# EAGLE board StepperBoard (EAGLE 9.6.2), part 1 of 2
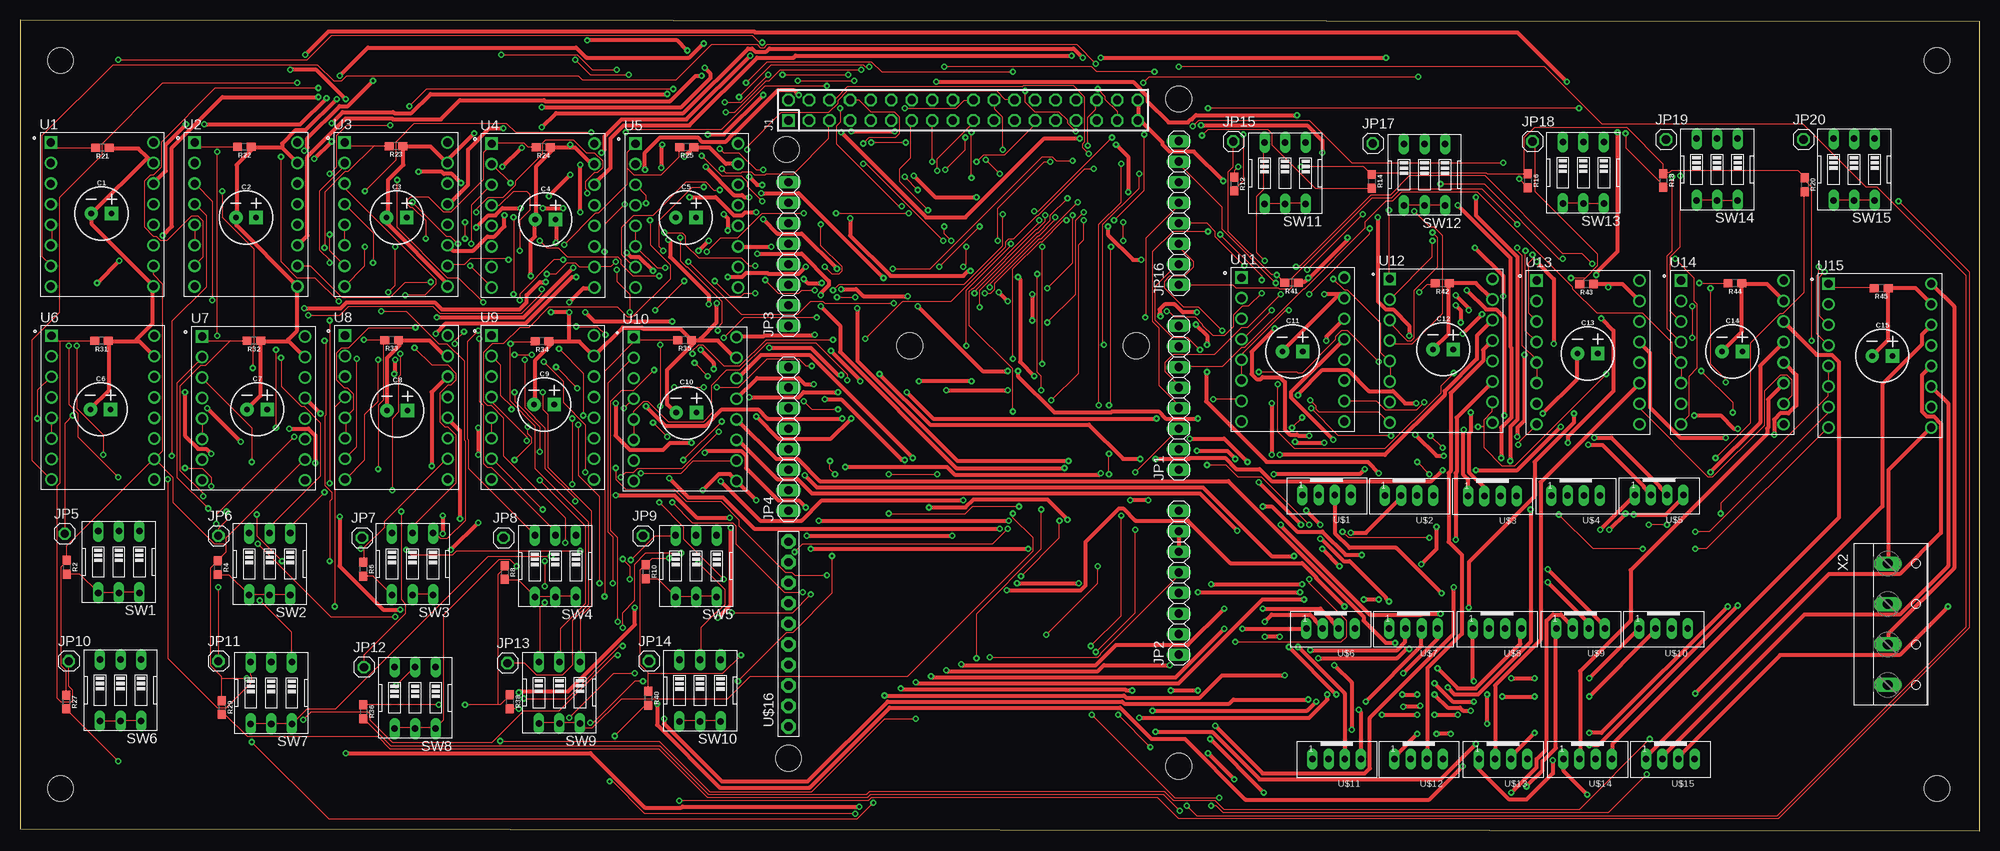
[diagram p2: board, top side]
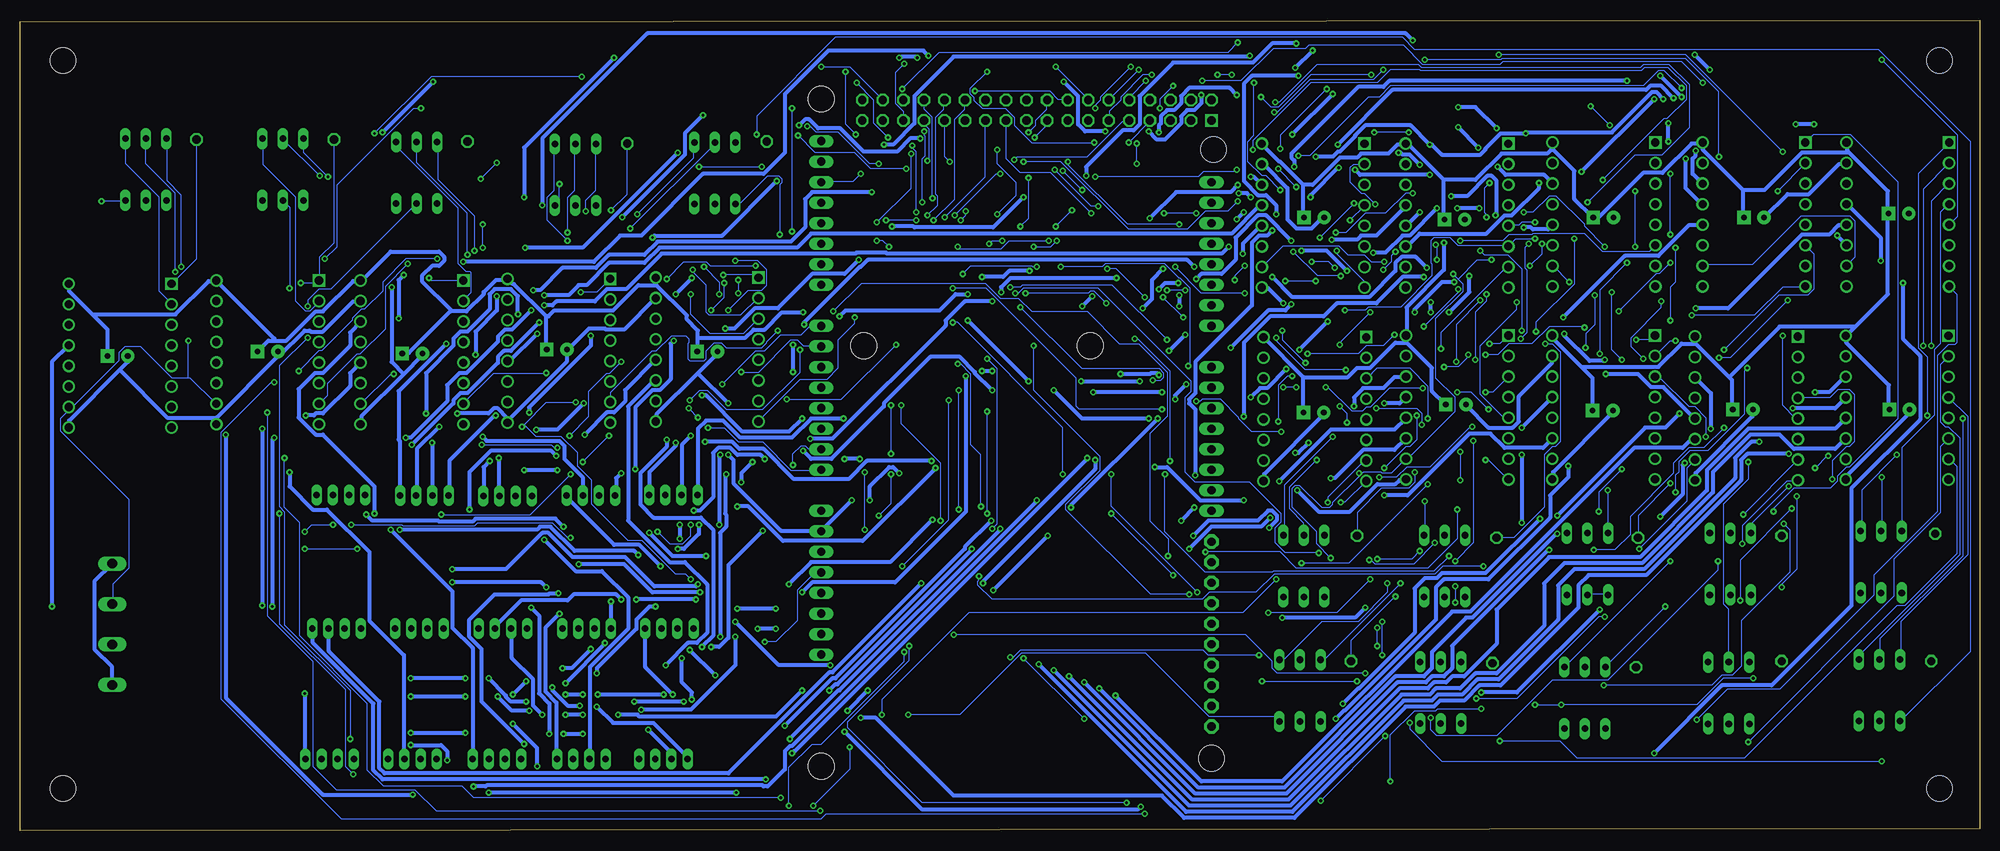
[diagram p3: board, bottom side, seen from below]

Size 242.3 x 100.2 mm. Coordinates in mm from the lower left corner, seen from the top.
Outline: 0,0.2 242.3,0 242.3,100 0,100.2 0,0.2
Copper layers (1*16): Top 0.035mm / dielectric 1.5mm / Bottom 0.035mm
Design rules "default": minimum track width 6mil, minimum drill 0.35mm, track to track 6mil, track to pad 6mil, pad to pad 6mil, via to via 6mil, smd to smd 6mil, copper to edge 40mil, drill to drill 6mil, minimum pad ring 10mil, minimum via ring 8mil, stop-mask expansion 4mil, vias tented up to drill 0mil, thermal gap 10mil
Net classes: 1 Motor: width 0.508 mm; 2 VMOT: width 0.508 mm; 3 GND: width 0.508 mm
Holes 3.2 mm at 5,95.2 5,5.2 237,5.2 237,95.2 94.75,84.2 95,8.95 143.25,90.45 143.25,7.95 110,59.95 138,59.95
tRestrict: area 1.8,92 to 8.2,98.4; area 1.8,2 to 8.2,8.4; area 233.8,2 to 240.2,8.4; area 233.8,92 to 240.2,98.4
bRestrict: area 1.8,92 to 8.2,98.4; area 1.8,2 to 8.2,8.4; area 233.8,2 to 240.2,8.4; area 233.8,92 to 240.2,98.4
vRestrict: area 1.8,92 to 8.2,98.4; area 1.8,2 to 8.2,8.4; area 233.8,2 to 240.2,8.4; area 233.8,92 to 240.2,98.4

## Footprints (pad centres in the part's own frame; a part is rotated, then mirrored left to right if it is on the bottom)
CPOL-RADIAL-2.5MM-6.5MM = drill 0.7 pad 1.651 square: 1 1.25,0 | drill 0.7 pad 1.651: 2 -1.25,0
DIL-100-2X18 = drill 1.016 square: 1 -21.59,-1.27 | drill 1.016 octagon: 2 -21.59,1.27; 3 -19.05,-1.27; 4 -19.05,1.27; 5 -16.51,-1.27; 6 -16.51,1.27; 7 -13.97,-1.27; 8 -13.97,1.27; 9 -11.43,-1.27; 10 -11.43,1.27; 11 -8.89,-1.27; 12 -8.89,1.27; 13 -6.35,-1.27; 14 -6.35,1.27; 15 -3.81,-1.27; 16 -3.81,1.27; 17 -1.27,-1.27; 18 -1.27,1.27; 19 1.27,-1.27; 20 1.27,1.27; 21 3.81,-1.27; 22 3.81,1.27; 23 6.35,-1.27; 24 6.35,1.27; 25 8.89,-1.27; 26 8.89,1.27; 27 11.43,-1.27; 28 11.43,1.27; 29 13.97,-1.27; 30 13.97,1.27; 31 16.51,-1.27; 32 16.51,1.27; 33 19.05,-1.27; 34 19.05,1.27; 35 21.59,-1.27; 36 21.59,1.27
1X08 = drill 1.016 long: 1 -8.89,0; 2 -6.35,0; 3 -3.81,0; 4 -1.27,0; 5 1.27,0; 6 3.81,0; 7 6.35,0; 8 8.89,0
1X01 = drill 1.016 octagon: 1 0,0
0603 = smd 1.1 x 1: 1 -0.85,0; 2 0.85,0
EDG-03 = drill 0.813 long: 1 -2.54,-3.81; 2 0,-3.81; 3 2.54,-3.81; 4 2.54,3.81; 5 0,3.81; 6 -2.54,3.81
MODULE_A4988_STEPPER_MOTOR_DRIVER_CARRIER = drill 1.02 square: 1 -6.35,8.89 | drill 1.02: 2 -6.35,6.35; 3 -6.35,3.81; 4 -6.35,1.27; 5 -6.35,-1.27; 6 -6.35,-3.81; 7 -6.35,-6.35; 8 -6.35,-8.89; 9 6.35,-8.89; 10 6.35,-6.35; 11 6.35,-3.81; 12 6.35,-1.27; 13 6.35,1.27; 14 6.35,3.81; 15 6.35,6.35; 16 6.35,8.89
JST_B4B-PH_HEADER = drill 0.8 long: P1 2.98,0.048; P2 0.98,0.048; P3 -1.02,0.048; P4 -3.02,0.048
1X10-BIG = drill 1.016 pad 1.778 octagon: 1 -11.43,0; 2 -8.89,0; 3 -6.35,0; 4 -3.81,0; 5 -1.27,0; 6 1.27,0; 7 3.81,0; 8 6.35,0; 9 8.89,0; 10 11.43,0
W237-4 = drill 1.194 long: 1 -7.5,-1.27; 2 -2.5,-1.27; 3 2.5,-1.27; 4 7.5,-1.27

## Placement (x,y rotation side)
C1  100uF  [CPOL-RADIAL-2.5MM-6.5MM]  10.04,76.3 0 top
C2  100uF  [CPOL-RADIAL-2.5MM-6.5MM]  27.92,75.8 0 top
C3  100uF  [CPOL-RADIAL-2.5MM-6.5MM]  46.55,75.8 0 top
C4  100uF  [CPOL-RADIAL-2.5MM-6.5MM]  64.93,75.55 0 top
C5  100uF  [CPOL-RADIAL-2.5MM-6.5MM]  82.31,75.8 0 top
C6  100uF  [CPOL-RADIAL-2.5MM-6.5MM]  9.93,52.08 0 top
C7  100uF  [CPOL-RADIAL-2.5MM-6.5MM]  29.3,52.08 0 top
C8  100uF  [CPOL-RADIAL-2.5MM-6.5MM]  46.62,51.93 0 top
C9  100uF  [CPOL-RADIAL-2.5MM-6.5MM]  64.79,52.68 0 top
C10  100uF  [CPOL-RADIAL-2.5MM-6.5MM]  82.36,51.68 0 top
C11  100uF  [CPOL-RADIAL-2.5MM-6.5MM]  157.33,59.25 0 top
C12  100uF  [CPOL-RADIAL-2.5MM-6.5MM]  175.95,59.5 0 top
C13  100uF  [CPOL-RADIAL-2.5MM-6.5MM]  193.82,59 0 top
C14  100uF  [CPOL-RADIAL-2.5MM-6.5MM]  211.69,59.25 0 top
C15  100uF  [CPOL-RADIAL-2.5MM-6.5MM]  230.25,58.7 0 top
J1  F-2X18-DIL-100  [DIL-100-2X18]  116.59,89.07 0 top
JP1  [1X08]  143.26,53.51 90 top
JP2  [1X08]  143.26,30.65 90 top
JP3  [1X08]  95,71.29 90 top
JP4  [1X08]  95,48.43 90 top
JP5  [1X01]  5.5,36.7 0 top
JP6  [1X01]  24.5,36.45 0 top
JP7  [1X01]  42.25,36.2 0 top
JP8  [1X01]  59.75,36.2 0 top
JP9  [1X01]  77,36.45 0 top
JP10  [1X01]  6,20.95 0 top
JP11  [1X01]  24.5,20.95 0 top
JP12  [1X01]  42.5,20.2 0 top
JP13  [1X01]  60.25,20.7 0 top
JP14  [1X01]  77.75,20.95 0 top
JP15  [1X01]  150,85.2 0 top
JP16  [1X08]  143.26,76.37 90 top
JP17  [1X01]  167.25,84.95 0 top
JP18  [1X01]  187,85.2 0 top
JP19  [1X01]  203.5,85.45 0 top
JP20  [1X01]  220.5,85.45 0 top
R2  4.7k  [0603]  5.75,32.56 270 top
R4  4.7k  [0603]  24.43,32.51 270 top
R6  4.7k  [0603]  42.41,32.31 270 top
R8  4.7k  [0603]  59.89,31.91 270 top
R10  4.7k  [0603]  77.37,32.01 270 top
R12  4.7k  [0603]  150.12,79.94 270 top
R14  4.7k  [0603]  167.12,80.27 270 top
R16  4.7k  [0603]  186.42,80.35 270 top
R18  4.7k  [0603]  203.17,80.38 270 top
R20  4.7k  [0603]  220.65,79.86 270 top
R21  4.7k  [0603]  10.17,84.42 180 top
R22  4.7k  [0603]  27.72,84.53 180 top
R23  4.7k  [0603]  46.47,84.64 180 top
R24  4.7k  [0603]  64.67,84.5 180 top
R25  4.7k  [0603]  82.42,84.51 180 top
R27  4.7k  [0603]  5.69,15.89 270 top
R29  4.7k  [0603]  24.94,15.22 270 top
R31  4.7k  [0603]  10.05,60.55 180 top
R32  4.7k  [0603]  28.89,60.55 180 top
R33  4.7k  [0603]  45.93,60.65 180 top
R34  4.7k  [0603]  64.52,60.5 180 top
R35  4.7k  [0603]  82.16,60.65 180 top
R36  4.7k  [0603]  42.44,14.7 270 top
R38  4.7k  [0603]  60.54,15.93 270 top
R40  4.7k  [0603]  77.67,16.36 270 top
R41  4.7k  [0603]  157.2,67.73 180 top
R42  4.7k  [0603]  175.84,67.68 180 top
R43  4.7k  [0603]  193.68,67.58 180 top
R44  4.7k  [0603]  212.02,67.68 180 top
R45  4.7k  [0603]  230.11,67.08 180 top
SW1  [EDG-03]  12.19,33.21 180 top
SW2  [EDG-03]  30.85,32.96 180 top
SW3  [EDG-03]  48.51,32.96 180 top
SW4  [EDG-03]  66.17,32.71 180 top
SW5  [EDG-03]  83.58,32.71 180 top
SW6  [EDG-03]  12.4,17.36 180 top
SW7  [EDG-03]  31.04,17.01 180 top
SW8  [EDG-03]  48.83,16.41 180 top
SW9  [EDG-03]  66.67,17.06 180 top
SW10  [EDG-03]  84.06,17.31 180 top
SW11  [EDG-03]  156.4,81.29 180 top
SW12  [EDG-03]  173.64,81.09 180 top
SW13  [EDG-03]  193.28,81.34 180 top
SW14  [EDG-03]  209.82,81.74 180 top
SW15  [EDG-03]  226.76,81.74 180 top
U1  A4988_STEPPER_MOTOR_DRIVER_CARRIER  [MODULE_A4988_STEPPER_MOTOR_DRIVER_CARRIER]  10.14,76.18 0 top
U2  A4988_STEPPER_MOTOR_DRIVER_CARRIER  [MODULE_A4988_STEPPER_MOTOR_DRIVER_CARRIER]  27.92,76.18 0 top
U3  A4988_STEPPER_MOTOR_DRIVER_CARRIER  [MODULE_A4988_STEPPER_MOTOR_DRIVER_CARRIER]  46.47,76.18 0 top
U4  A4988_STEPPER_MOTOR_DRIVER_CARRIER  [MODULE_A4988_STEPPER_MOTOR_DRIVER_CARRIER]  64.64,76.05 0 top
U5  A4988_STEPPER_MOTOR_DRIVER_CARRIER  [MODULE_A4988_STEPPER_MOTOR_DRIVER_CARRIER]  82.42,76.05 0 top
U6  A4988_STEPPER_MOTOR_DRIVER_CARRIER  [MODULE_A4988_STEPPER_MOTOR_DRIVER_CARRIER]  10.22,52.3 0 top
U7  A4988_STEPPER_MOTOR_DRIVER_CARRIER  [MODULE_A4988_STEPPER_MOTOR_DRIVER_CARRIER]  28.85,52.21 0 top
U8  A4988_STEPPER_MOTOR_DRIVER_CARRIER  [MODULE_A4988_STEPPER_MOTOR_DRIVER_CARRIER]  46.52,52.32 0 top
U9  A4988_STEPPER_MOTOR_DRIVER_CARRIER  [MODULE_A4988_STEPPER_MOTOR_DRIVER_CARRIER]  64.61,52.32 0 top
U10  A4988_STEPPER_MOTOR_DRIVER_CARRIER  [MODULE_A4988_STEPPER_MOTOR_DRIVER_CARRIER]  82.21,52.12 0 top
U11  A4988_STEPPER_MOTOR_DRIVER_CARRIER  [MODULE_A4988_STEPPER_MOTOR_DRIVER_CARRIER]  157.36,59.48 0 top
U12  A4988_STEPPER_MOTOR_DRIVER_CARRIER  [MODULE_A4988_STEPPER_MOTOR_DRIVER_CARRIER]  175.7,59.33 0 top
U13  A4988_STEPPER_MOTOR_DRIVER_CARRIER  [MODULE_A4988_STEPPER_MOTOR_DRIVER_CARRIER]  193.86,59.13 0 top
U14  A4988_STEPPER_MOTOR_DRIVER_CARRIER  [MODULE_A4988_STEPPER_MOTOR_DRIVER_CARRIER]  211.7,59.13 0 top
U15  A4988_STEPPER_MOTOR_DRIVER_CARRIER  [MODULE_A4988_STEPPER_MOTOR_DRIVER_CARRIER]  229.95,58.73 0 top
U$1  JST-PH_4-PIN_HEADER  [JST_B4B-PH_HEADER]  161.52,41.52 180 top
U$2  JST-PH_4-PIN_HEADER  [JST_B4B-PH_HEADER]  171.72,41.47 180 top
U$3  JST-PH_4-PIN_HEADER  [JST_B4B-PH_HEADER]  182.02,41.42 180 top
U$4  JST-PH_4-PIN_HEADER  [JST_B4B-PH_HEADER]  192.32,41.47 180 top
U$5  JST-PH_4-PIN_HEADER  [JST_B4B-PH_HEADER]  202.62,41.52 180 top
U$6  JST-PH_4-PIN_HEADER  [JST_B4B-PH_HEADER]  162.01,25.02 180 top
U$7  JST-PH_4-PIN_HEADER  [JST_B4B-PH_HEADER]  172.25,25.02 180 top
U$8  JST-PH_4-PIN_HEADER  [JST_B4B-PH_HEADER]  182.59,25.02 180 top
U$9  JST-PH_4-PIN_HEADER  [JST_B4B-PH_HEADER]  192.93,25.02 180 top
U$10  JST-PH_4-PIN_HEADER  [JST_B4B-PH_HEADER]  203.17,25.02 180 top
U$11  JST-PH_4-PIN_HEADER  [JST_B4B-PH_HEADER]  162.76,8.9 180 top
U$12  JST-PH_4-PIN_HEADER  [JST_B4B-PH_HEADER]  172.9,8.9 180 top
U$13  JST-PH_4-PIN_HEADER  [JST_B4B-PH_HEADER]  183.34,8.9 180 top
U$14  JST-PH_4-PIN_HEADER  [JST_B4B-PH_HEADER]  193.78,8.9 180 top
U$15  JST-PH_4-PIN_HEADER  [JST_B4B-PH_HEADER]  204.02,8.9 180 top
U$16  PINHD-1X10  [1X10-BIG]  95,24.3 90 top
X2  [W237-4]  232.19,25.51 270 top

## Tracks (layer width: path | path; a pad name or v marks a point on that pad's centre or on a via)
N$1  (via drill 0.35)
  Top 0.508: 15.75,83.2 16.38,82.58 U1.15 | 15.75,83.2 14.62,84.33 11.12,84.33 R21.1 | 15.75,83.2 8.88,76.33 C1.2 8.88,76.08 8.88,74.95 16.38,67.45 U1.9 16.38,67.2 16.38,62.7 14.38,60.7 14.38,60.45 | 14.38,60.45 14.75,60.45 16.5,58.7 U6.15 | 14.38,60.45 11,60.45 R31.1 11,60.2 11,54.45 8.75,52.2 C6.2 | 32.38,84.45 28.62,84.45 R22.1 28.62,84.2 26.75,82.33 26.75,75.83 C2.2 26.75,75.58 26.75,74.83 34.12,67.45 U2.9 34.25,67.2 34.25,61.83 33.12,60.7 33.12,60.45 | 32.38,84.45 34.25,82.58 U2.15 | 33.12,60.45 33.25,60.45 35.12,58.58 U7.15 | 33.12,60.45 29.75,60.45 R32.1 29.75,60.2 29.75,53.83 28.12,52.2 C7.2 | 84.12,60.58 86.25,60.58 88.25,58.58 88.5,58.58 U10.15 | 84.12,60.58 83.12,60.58 R35.1 | v86.12,65.2 86.12,62.83 84.12,60.83 84.12,60.58 | v84.38,42.08 86.38,44.08 87.75,44.08 88.5,43.33 U10.9 88.75,43.08 v91,40.83 | R35.1 83.12,60.33 83.12,60.08 80,56.95 80,52.7 81,51.7 C10.2 | U3.9 52.75,67.33 52.75,67.7 45.38,75.08 45.38,75.7 C3.2 45.5,75.95 45.5,80.45 47.38,82.33 47.38,84.33 R23.1 47.38,84.58 50.75,84.58 52.75,82.58 U3.15 52.75,82.83 v56.12,86.2 | U8.15 52.75,58.7 52.5,58.7 50.62,60.58 46.88,60.58 R33.1 46.88,60.33 46.88,59.95 45.38,58.45 45.38,51.95 C8.2 | U5.15 88.75,82.45 87.25,82.45 85.25,84.45 83.38,84.45 R25.1 83.12,84.33 v82.12,83.33 | 68,84.45 68.62,84.45 70.62,82.45 70.88,82.45 U4.15 | 68,84.45 65.62,84.45 R24.1 65.88,84.2 63.75,82.08 63.75,75.58 C4.2 63.62,75.33 63.62,73.45 63.12,72.95 v63.12,68.58 | 67.88,60.45 69.12,60.45 70.88,58.7 U9.15 71.12,58.83 74.5,62.2 76.88,62.2 77,62.08 81.62,62.08 82.88,60.83 R35.1 | 67.88,60.45 65.38,60.45 R34.1 65.75,60.2 63.62,58.08 63.62,52.7 C9.2
  Top 0.508: v67.88,65.33 69.62,67.08 70.88,67.08 U4.9 | 67.88,60.45 v67.88,64.08 v65.62,64.08 | v68,84.83 68,84.45 | v39.12,90.45 35.25,86.58 34,86.58 32.38,84.95 32.38,84.45 | 196.38,67.58 198.12,67.58 200.12,65.58 U13.15 | 196.38,67.58 194.62,67.58 R43.1 | U14.15 218,65.58 216,67.58 212.88,67.58 R44.1 212.88,67.33 212.88,61.7 210.5,59.33 C14.2 | v196.38,67.2 196.38,67.58 | U15.15 236.25,65.2 234.38,67.08 231,67.08 R45.1 231,66.83 231,60.7 C15.2 | X2.1 231,33.08 231,44.58 236.25,49.83 U15.9 | JP2.6 143.25,34.58 143.25,36.95 JP2.7 | v154.75,52.83 v154.75,46.45 | U12.15 182,65.7 180,67.7 176.75,67.7 R42.1 176.62,67.45 176.62,61.45 174.75,59.58 C12.2 | J1.36 138.25,90.33 138.25,87.83 J1.35 138.5,87.83 141.25,85.08 141.25,84.83 142.12,83.95 145.12,83.95 v148.75,80.33 | 162.88,66.33 163.25,66.33 163.62,65.95 U11.15 | 162.88,66.33 v161.25,66.33 | R41.1 158.12,67.83 158.75,67.83 v159.25,68.33 159.38,68.33 164.12,73.08 v164.12,73.33 | C11.2 156.12,59.33 162.88,66.08 162.88,66.33 | v188.25,51.58 192.5,55.83 192.5,58.95 C13.2 | v102,44.95 114.62,44.95 115.62,43.95 133.38,43.95 v133.62,44.2 | v139.5,40.83 v137.25,40.83
  Bottom 0.508: U6.9 16.5,43.45 16.5,43.83 8.75,51.58 8.75,52.08 C6.2 | U7.9 35.12,43.33 35.12,44.2 28.12,51.2 28.12,52.08 C7.2 | U1.15 16.5,82.45 17.38,82.45 21.12,78.7 23.75,78.7 26.62,75.83 C2.2 | v86.12,65.2 88,67.08 88.75,67.08 U5.9 | U10.9 88.5,43.33 88.5,44.08 81,51.58 C10.2 | v84.38,42.08 81.75,39.45 77.88,39.45 74.5,42.83 72.25,42.83 71.75,43.33 71,43.33 U9.9 | U8.9 52.75,43.45 52.75,44.33 45.25,51.83 C8.2 | C5.2 81.12,75.7 81.38,75.7 82.62,74.45 84.5,74.45 85.62,75.58 85.62,79.45 88.5,82.33 88.75,82.33 U5.15 | v67.88,64.08 v67.88,65.33 | v63.12,68.58 63.12,66.58 v65.62,64.08 | v82.12,83.33 80,83.33 79.38,83.95 79.12,83.95 77.25,85.83 77.25,85.95 76,87.2 70.38,87.2 v68,84.83 67.75,84.83 66.5,83.58 61.75,83.58 61.12,84.2 61.12,84.33 59.25,86.2 v56.12,86.2 56,86.33 45.5,86.33 40.5,91.33 40,91.33 v39.12,90.45 | U8.15 52.88,58.58 52.88,57.83 57,53.7 57,50.58 57.75,49.83 60.75,49.83 63.5,52.58 C9.2 | 194.88,56.45 192.62,58.7 192.62,58.95 C13.2 | 194.88,56.45 200.12,51.2 200.12,50.33 U13.9 | 218,51.08 218,50.33 U14.9 | 218,51.08 210.5,58.58 210.5,59.2 C14.2 210.25,58.7 207.12,61.83 206.5,61.83 206.38,61.7 204.88,61.7 201.12,65.45 200.25,65.45 U13.15 | 194.88,56.45 196.38,57.95 v196.38,67.2 | X2.4 231,18.07 231,20.32 233.12,22.45 233.12,30.82 231,32.95 X2.1 | 230,56.95 229,57.95 C15.2 | 230,56.95 236.25,50.7 236.25,49.95 U15.9 | 218,51.08 224.12,51.08 230,56.95 | 158.5,56.58 156.12,58.95 156.12,59.2 C11.2 | 158.5,56.58 163.62,51.45 163.62,50.7 U11.9 | v154.75,46.45 154.12,45.83 154.12,42.95 148.25,37.08 143.38,37.08 JP2.7 143.12,37.2 v139.5,40.83 | 158.5,56.58 v154.75,52.83
  Bottom 0.508: v161.25,66.33 v159.25,68.33 | v148.75,80.33 155.5,73.58 163.88,73.58 v164.12,73.33 | U11.15 163.75,65.83 167.62,61.95 169.88,61.95 170,62.08 172,62.08 174.5,59.58 C12.2 174.75,59.45 174.75,57.95 182,50.7 182,50.45 U12.9 182,50.95 183.25,52.2 183.75,52.2 184.38,51.58 v188.25,51.58 | v91,40.83 96.38,40.83 100.5,44.95 v102,44.95 | v133.62,44.2 134.38,44.95 134.88,44.95 137.25,42.58 v137.25,40.83
N$2  (via drill 0.35)
  Top 0.508: v66.25,72.7 66.25,75.45 C4.1 | X2.3 231,23.07 231,24.32 239.12,32.45 239.12,64.83 236.38,67.58 U15.16 | v98.25,61.33 98.12,61.2 92,61.2 91.88,61.08 88.62,61.08 U10.16 | v100.25,59.33 103.88,55.7 v103.88,55.58 | v117.62,55.58 v111.12,55.58 | v125.12,66.33 v125.12,63.08 | v141,63.58 141,63.83 140.88,63.95 140.88,64.45 141.5,65.08 142.75,65.08 143.75,64.08 v145.5,64.08
  Bottom 0.508: 70.88,60.33 70.88,61.2 U9.16 70.88,61.45 70.88,64.7 66.25,69.33 v66.25,72.7 | 70.88,60.33 67.75,57.2 67.75,54.33 66.12,52.7 C9.1 | 83.62,56.08 U10.16 | 83.62,56.08 83.62,51.7 C10.1 | 70.88,60.33 72.25,60.33 75.38,57.2 77,57.2 78.12,56.08 83.62,56.08 | 83.62,79.83 86.5,82.7 86.62,82.7 88.75,84.83 U5.16 | 83.62,79.83 83.62,75.83 C5.1 | 66.25,80.45 70.62,84.83 70.88,84.83 U4.16 71.12,84.83 72,84.83 73.12,83.7 76.5,83.7 77,83.2 79.12,83.2 82.5,79.83 83.62,79.83 | 66.25,80.45 66.25,75.58 C4.1 | 52.75,84.2 52.75,84.95 U3.16 | 52.75,84.2 50.12,81.58 50.12,78.08 47.88,75.83 C3.1 47.62,75.95 47,75.95 41.62,81.33 39.25,81.33 35.62,84.95 34.5,84.95 U2.16 34.25,84.95 34.25,84.2 29.25,79.2 | 66.25,80.45 62.38,80.45 59.12,83.7 53.5,83.7 53,84.2 52.75,84.2 | 35.12,60.2 35.12,61.08 U7.16 | 31,56.08 30.62,55.7 30.62,52.2 C7.1 | 31,56.08 35.12,60.2 | 49.12,57.2 47.88,55.95 47.88,51.95 C8.1 | 49.12,57.2 52.75,60.83 52.75,61.2 U8.16 | 35.12,60.2 36.88,60.2 39.75,57.33 49,57.33 49.12,57.2 | 29.25,79.2 29.25,75.83 C2.1 | 16.38,84.08 16.38,84.95 U1.16 | 16.38,84.08 11.38,79.08 11.38,76.33 C1.1 11.38,76.08 11.38,66.33 15.5,62.2 | C6.1 11.25,52.2 11.25,55.08 16.5,60.33 16.5,61.08 U6.16 16.38,61.33 15.5,62.2 | 29.25,79.2 26.62,79.2 22,83.83 16.38,83.83 16.38,84.08 | 31,56.08 24.75,62.33 15.62,62.33 15.5,62.2 | 163.62,67.45 163.62,68.33 U11.16 | 163.62,67.45 159.88,63.7 159.88,63.2 158.5,61.83 158.5,60.95 | 158.5,60.95 158.5,59.33 C11.1 | 177.25,63.58 181.25,67.58 181.38,67.58 182,68.2 U12.16 182.25,68.08 183.5,68.08 185,66.58 185,66.33 187.12,64.2 189.12,64.2 | 177.25,63.58 177.25,59.58 C12.1
  Bottom 0.508: 189.12,64.2 194.25,59.08 195,59.08 C13.1 | 163.62,67.45 165.88,67.45 169,64.33 176.25,64.33 177,63.58 177.25,63.58 | 210.88,60.58 211.62,60.58 212.88,59.33 C14.1 | 210.88,60.58 209.38,60.58 205.75,64.2 204.88,64.2 201.12,67.95 200.25,67.95 U13.16 200,68.08 196.5,71.58 190.5,71.58 189.88,70.95 189.88,70.45 190.5,69.83 191.38,69.83 192.62,68.58 192.62,67.95 189.12,64.45 189.12,64.2 | 210.88,60.58 210.88,60.83 218,67.95 U14.16 218.25,67.95 219,67.95 223.12,63.83 233.12,63.83 233.25,63.7 | 233.25,63.7 231.5,61.95 C15.1 | 233.25,63.7 236.25,66.7 236.25,67.58 U15.16 | v100.25,59.33 v98.25,61.33 | v111.12,55.58 v103.88,55.58 | v125.12,63.08 v117.62,55.58 | v125.12,66.33 126.62,66.33 128.62,64.33 140.25,64.33 v141,63.58 | v145.5,64.08 148.12,64.08 150.25,61.95 151.62,61.95 152.62,60.95 158.5,60.95
N$3  (via drill 0.35)
  Top 0.152: R21.2 9.25,84.45 4.38,84.45 3.88,84.95 U1.1 | JP5.1 5.5,50.33 v6.5,51.33
  Bottom 0.152: v6.5,51.33 6.5,58.58 7.62,59.7 7.62,81.2 3.88,84.95 U1.1
N$4  (via drill 0.35)
  Top 0.152: v133.25,91.7 134.12,90.83 134.12,90.45 135.62,88.95 135.62,87.83 J1.33 | v91.75,97.45 91.38,97.45 90.5,98.33 38.5,98.33 35.5,95.33 v12.12,95.33 | U1.6 3.88,72.45 3.88,74.83 U1.5
  Bottom 0.152: v133.25,91.7 128.75,96.2 93,96.2 v91.75,97.45 | v12.12,95.33 2.75,85.95 2.75,75.95 U1.5
N$5  (via drill 0.35)
  Top 0.152: SW7.4 SW7.5 SW7.6 33.62,13.2 35.5,15.07 39,15.07 57.88,33.95 v65.62,33.95 | v146.12,85.95 146.88,86.7 154.25,86.7 154.75,86.2 154.75,84.83 160.12,79.45 167,79.45 R14.2 | v132.75,81.83 131.62,81.83 125.88,76.08 125.75,76.08 122.88,73.2 122.25,73.2 121.88,72.83 121.88,72.2 115.12,65.45 109.12,65.45 v104.5,60.83 | v100.12,45.7 100.12,44.7 v100.75,44.08
  Bottom 0.152: v146.12,85.95 144,83.83 139.12,83.83 137.12,81.83 v132.75,81.83 | v104.5,60.83 104.12,60.83 100.12,56.83 v100.12,45.7 | v100.75,44.08 100.75,36.95 95.75,31.95 87.5,31.95 87.38,32.08 67.5,32.08 v65.62,33.95
N$6  (via drill 0.35)
  Top 0.152: SW7.3 28.5,19.2 28.62,19.07 28.62,18.32 25.5,15.2 24.38,15.2 18.25,21.32 v18.25,43.45
  Bottom 0.152: v18.25,43.45 18.25,45.7 16.5,47.45 16.12,47.45 15.5,48.08 15.5,53.95 16.12,54.58 17.5,54.58 18.5,53.58 22.5,53.58 U7.4
N$7  (via drill 0.35)
  Top 0.152: v28.62,45.58 28.62,49.83 22.5,55.95 U7.3
  Bottom 0.152: v28.62,45.58 28.62,43.45 31.75,40.33 31.75,28.07 31.12,27.45 31.12,20.82 SW7.2
N$9
  Top 0.152: R4.2 24.5,31.57 25.88,31.57 28.25,29.2 SW2.4 28.38,29.2 30.75,29.2 SW2.5 30.88,29.2 33.38,29.2 SW2.6
N$10  (via drill 0.35)
  Top 0.152: v23.62,42.58 23.62,43.7 22.5,44.83 v20.38,44.83 | v18.75,46.33 18.75,62.95 23,67.2 23,76.08 21.62,77.45 U2.4
  Bottom 0.152: v23.62,42.58 28.25,37.95 28.25,36.83 SW2.3 | v20.38,44.83 18.88,46.33 v18.75,46.33
N$11  (via drill 0.35)
  Top 0.152: v32.25,58.45 32.25,54.95 34.75,52.45 35.12,52.45 37.12,50.45 37.12,43.83 30.88,37.58 30.88,36.83 SW2.2 | v23.75,65.58 23.75,77.83 21.62,79.95 U2.3
  Bottom 0.152: v32.25,58.45 30.88,58.45 v23.75,65.58
N$12  (via drill 0.35)
  Top 0.152: v37.62,41.83 33.5,37.7 33.5,36.83 SW2.1 | v28.75,57.2 28.75,59.83 28.88,59.95 28.88,71.95 25,75.83 v25,79.08
  Bottom 0.152: v37.62,41.83 37.62,43.95 37.25,44.33 37.25,45.58 35.88,46.95 33.62,46.95 29.12,51.45 29.12,56.83 v28.75,57.2 | v25,79.08 21.62,82.45 U2.2
N$13  (via drill 0.35)
  Top 0.508: v161.25,47.95 157.75,47.95 v157.62,48.08 | v129.62,45.7 115.88,45.7 103.5,58.08 v103.5,64.58 | v101,69.45 96.62,73.83 93.62,73.83 v91.88,75.58 | v91,76.45 89.62,76.45 89.25,76.08 88.25,76.08 86,78.33 v82.75,78.33 | v79.25,81.95 79.25,84.7 v79.38,84.83 | v37.88,90.58 34.62,87.33 v22.75,87.33 | v20.5,87.33 18,84.83 18,81.58 16.5,80.08 U1.14
  Bottom 0.508: v161.25,47.95 161.25,47.58 164.5,44.33 164.5,41.58 U$1.P4 | v157.62,48.08 154.25,48.08 153.38,47.2 150.38,47.2 146.62,43.45 139.88,43.45 137.62,45.7 v129.62,45.7 | v103.5,64.58 102.38,65.7 102.38,68.08 v101,69.45 | v91,76.45 v91.88,75.58 | v82.75,78.33 82.75,78.58 79.38,81.95 v79.25,81.95 | v79.38,84.83 72.62,91.58 41.25,91.58 40.75,92.08 39.38,92.08 v37.88,90.58 | v20.5,87.33 v22.75,87.33
N$14  (via drill 0.35)
  Top 0.508: v175.75,29.32 170.12,34.95 164.38,34.95 162.62,36.7 162.62,41.45 U$1.P3 | v180,10.7 175.62,6.33 153.25,6.33 147.38,12.2 v140.38,12.2 | v103.75,2.95 81.88,2.95 81.75,2.83 77.25,2.83 70.5,9.57 v40.25,9.57 | v12.25,70.45 v9.5,67.7
  Bottom 0.508: v175.75,29.32 176.88,29.32 177,29.2 183.62,29.2 186.75,26.07 186.75,23.95 185.25,22.45 185.25,15.95 v180,10.7 | v140.38,12.2 130.75,2.58 104.12,2.58 v103.75,2.95 | v40.25,9.57 31.88,17.95 25.75,17.95 15.88,27.82 15.88,42.33 7.38,50.83 7.38,58.7 9.5,60.83 v9.5,67.7 | v12.25,70.45 12.25,73.33 16.38,77.45 U1.13
N$15  (via drill 0.35)
  Top 0.508: v159.38,48.83 158,48.83 157.88,48.95 157,48.95 156.38,49.58 156.38,55.45 155.75,56.08 153.62,56.08 153.38,55.83 152.88,55.83 152.25,56.45 152.25,59.2 v155.12,62.08 | v138.62,70.58 137.62,70.58 134.5,73.7 v134.5,74.7 | v118.25,78.33 113.12,78.33 v110.5,80.95 | v84.5,97.33 82.75,95.58 70,95.58 68.75,96.83 43,96.83 v39.5,93.33 | v36.88,90.7 25,90.7 18.75,84.45 18.75,74.7 v17.62,73.58
  Bottom 0.508: v159.38,48.83 160.5,47.7 160.5,41.58 U$1.P2 | v155.12,62.08 154,62.08 151.5,64.58 148.62,64.58 144.38,68.83 140.38,68.83 v138.62,70.58 | v134.5,74.7 131.88,74.7 131.75,74.58 122,74.58 v118.25,78.33 | v110.5,80.95 110.5,82.08 106,86.58 104.62,86.58 103.88,87.33 103.88,90.83 99.75,94.95 89.88,94.95 87.5,97.33 v84.5,97.33 | v36.88,90.7 v39.5,93.33 | v17.62,73.58 16.5,72.45 U1.11
N$16  (via drill 0.35)
  Top 0.508: v140.5,50.95 112.88,50.95 v109.62,54.2 | v101.12,54.2 96.88,54.2 96.25,53.58 v90.12,53.58 | v85.75,57.08 85.75,57.83 v84.12,59.45 | v80.62,62.95 71,62.95 v69.88,64.08 | v65,67.83 64.25,67.83 62.62,66.2 62.62,65.33 61.75,64.45 52.12,64.45 51.25,65.33 40.38,65.33 39.62,64.58 v35.12,64.58
  Bottom 0.508: v140.5,50.95 144.5,50.95 146.88,48.58 153.25,48.58 155.38,50.7 157.5,50.7 158.5,49.7 158.5,41.58 U$1.P1 | v101.12,54.2 v109.62,54.2 | v90.12,53.58 89,54.7 88.12,54.7 v85.75,57.08 | v80.62,62.95 v84.12,59.45 | v69.88,64.08 69.88,64.45 66.5,67.83 v65,67.83 | v35.12,64.58 31.12,64.58 22,73.7 18.62,73.7 17.5,74.83 16.5,74.83 U1.12
N$17  (via drill 0.35)
  Top 0.508: v168,44.2 166.62,45.58 154.12,45.58 146.62,53.08 146.62,56.58 v146.75,56.7 | v146.75,60.08 146.75,61.2 v145.38,62.58 | v97.12,69.7 96.25,68.83 92.5,68.83 92.38,68.95 89.75,68.95 89.25,68.45 v87.5,68.45 | v68.38,69.58 62.25,63.45 v51.5,63.45
  Bottom 0.508: v168,44.2 168.62,43.58 168.62,41.45 U$2.P1 | v146.75,60.08 v146.75,56.7 | v145.38,62.58 145.38,62.83 138.5,69.7 138.38,69.7 137.5,70.58 98,70.58 v97.12,69.7 | v87.5,68.45 85,65.95 75.5,65.95 72.25,69.2 72.25,70.2 71.5,70.95 69.75,70.95 v68.38,69.58 | v51.5,63.45 43.88,71.08 39.75,71.08 36,74.83 34.38,74.83 U2.12
N$18
  Bottom 0.152: SW1.3 9.62,37.08 9.62,47.33 5.62,51.33 5.62,59.45 4.88,60.2 4.88,76.45 3.88,77.45 U1.4
N$19  (via drill 0.35)
  Top 0.152: v12.12,43.7 7.12,48.7 7.12,51.58 6,52.7 v6,59.95
  Bottom 0.152: v12.12,43.7 12.12,37.08 SW1.2 | v6,59.95 6,77.83 3.88,79.95 U1.3
N$20  (via drill 0.35)
  Top 0.152: v10.25,46.45 10.25,48.95 7,52.2 v7,59.95
  Bottom 0.152: v10.25,46.45 14.62,42.08 14.62,37.08 SW1.1 | v7,59.95 7,79.33 3.88,82.45 U1.2
N$21
  Top 0.152: SW1.6 14.62,29.45 12.25,29.45 SW1.5 12.12,29.45 9.75,29.45 SW1.4 9.62,29.45 7.38,31.7 R2.2
N$22
  Top 0.152: SW3.5 48.62,29.2 51,29.2 SW3.6 | R6.2 42.5,31.45 43.62,31.45 45.88,29.2 SW3.4
  Bottom 0.152: SW3.5 48.5,29.2 46,29.2 SW3.4
N$23  (via drill 0.35)
  Top 0.152: v46,42.08 46,50.95 46.75,51.7 46.75,56.08 47,56.33 v47,58.95 | v43.62,70.2 43.62,73.95 U3.4
  Bottom 0.152: v46,42.08 46,36.83 SW3.3 | v47,58.95 47,66.83 v43.62,70.2
N$24  (via drill 0.35)
  Top 0.152: v48.75,59.7 50.88,57.58 52.88,57.58 53.88,56.58 53.88,55.7 53.25,55.08 52.88,55.08 51.88,54.08 51.88,50.58 52.5,49.95 52.88,49.95 53.88,48.95 53.88,42.95 48.62,37.7 48.62,36.83 SW3.2 | v47.62,66.2 50,66.2 51.38,67.58 51.38,68.2 40.12,79.45 40.12,79.95 U3.3
  Bottom 0.152: v48.75,59.7 48.75,61.45 47.62,62.58 v47.62,66.2
N$25  (via drill 0.35)
  Top 0.152: v44.62,64.2 47.75,64.2 51.75,60.2 52.75,60.2 54.88,58.08 54.88,48.33 55,48.2 55,38.33 52.75,36.08 52,36.08 51.38,36.7 51.12,36.7 SW3.1 | v38.25,70.2 38.25,70.58 37,71.83 37,79.08 40,82.08 40,82.45 U3.2
  Bottom 0.152: v44.62,64.2 40,68.83 39.62,68.83 v38.25,70.2
N$26
  Top 0.152: SW4.6 68.62,28.95 66.25,28.95 SW4.5 66.12,28.95 63.75,28.95 SW4.4 63.62,28.95 61.62,30.95 60,30.95 R8.2
N$27  (via drill 0.35)
  Top 0.152: v56.62,61.83 55.25,60.45 55.25,48.45 55.38,48.33 55.38,44.83 63.62,36.58 SW4.3 | v61.75,71.7 61.75,75.45 63,76.7 63,78.7 62.62,79.08 61,79.08 59.25,77.33 58.38,77.33 U4.4
  Bottom 0.152: v56.62,61.83 56.62,69.45 58.38,71.2 61.25,71.2 v61.75,71.7
N$28  (via drill 0.35)
  Top 0.152: v56.75,60.83 56.75,53.08 57.25,52.58 57.25,45.45 57.75,44.95 58.25,44.95 66.12,37.08 66.12,36.58 SW4.2 | v55.75,72.58 55.75,77.33 58.25,79.83 U4.3
  Bottom 0.152: v56.75,60.83 56,61.58 56,69.33 56.25,69.58 56.25,72.08 v55.75,72.58
N$29  (via drill 0.35)
  Top 0.152: v68.62,40.7 68.62,41.08 64.88,44.83 64.88,49.83 62.38,52.33 v62.38,58.2 | v61,75.83 v61,66.33 | v60.62,80.08 58.38,82.33 U4.2
  Bottom 0.152: v68.62,40.7 68.62,36.58 SW4.1 | v62.38,58.2 62.38,64.08 61,65.45 v61,66.33 | v61,75.83 61,76.2 61.25,76.45 61.25,79.45 v60.62,80.08
N$30
  Top 0.152: SW5.6 86,28.95 83.62,28.95 SW5.5 83.5,28.95 81.12,28.95 SW5.4 81,28.95 78.88,31.07 77.38,31.07 R10.2
N$31  (via drill 0.35)
  Top 0.152: v75.5,33.45 78.5,36.45 81,36.45 SW5.3 | v67.38,35.58 67.38,38.7 59.75,46.33 59.75,51.08 58.25,52.58 57.75,52.58 57.25,53.08 57.25,59.08 58.38,60.2 59.75,60.2 61.75,62.2 62.88,62.2 65.38,64.7 73.88,64.7 75.12,63.45 75.62,63.45 80.38,68.2 80.38,69.95 77.88,72.45 v77.88,75.45
  Bottom 0.152: v75.5,33.45 75.25,33.45 74.75,32.95 70,32.95 v67.38,35.58 | v77.88,75.45 76.12,77.2 U5.4
N$32  (via drill 0.35)
  Top 0.152: v86.75,50.58 v82,45.83 | v83.38,57.83 v85,56.2 | v86.25,61.83 86.25,62.2 86.75,62.7 86.75,65.45 82.5,69.7 82.38,69.7 81.62,70.45 v81.62,73.33 | v77.38,77.58 77.38,78.58 76.12,79.83 U5.3
  Bottom 0.152: v82,45.83 85.38,42.45 85.38,39.83 83.62,38.08 83.62,36.58 SW5.2 | v86.75,50.58 86.75,55.08 85.62,56.2 v85,56.2 | v83.38,57.83 86.25,60.7 v86.25,61.83 | v77.38,77.58 v81.62,73.33
N$33  (via drill 0.35)
  Top 0.152: v78.25,50.45 v80,48.7 | v79.12,60.08 v79.12,52.45 | v75.38,64.08 75.38,66.33 73.75,67.95 v73.75,69.33 | v72.25,71.58 72.25,74.95 v74.75,77.45
  Bottom 0.152: v80,48.7 86,42.7 86,36.58 SW5.1 | v78.25,50.45 78.25,51.58 v79.12,52.45 | v79.12,60.08 79.12,60.33 v75.38,64.08 | v73.75,69.33 72.75,70.33 72.75,71.08 v72.25,71.58 | v74.75,77.45 76.12,78.83 76.5,78.83 77.88,80.2 77.88,81.95 77.5,82.33 76.12,82.33 U5.2
N$34  (via drill 0.35)
  Top 0.152: R22.2 26.75,84.58 22,84.58 21.62,84.95 U2.1 | JP6.1 24.5,37.33 25.5,38.33 v25.5,39.45
  Bottom 0.152: v25.5,39.45 25.5,39.83 23,42.33 18.5,42.33 17.62,43.2 17.62,43.83 16.5,44.95 16.12,44.95 10.12,50.95 10.12,80.2 16,86.08 20.5,86.08 21.5,85.08 U2.1
N$36  (via drill 0.35)
  Top 0.152: 43.75,84.7 40.38,84.7 40.12,84.95 U3.1 | 43.75,84.7 45.5,84.7 R23.2 | v38.25,63.08 v38.25,42.95 | v37.62,72.08 37.62,78.95 40.12,81.45 40.5,81.45 43.75,84.7
  Bottom 0.152: JP7.1 42.25,38.95 v38.25,42.95 | v38.25,63.08 38.25,67.2 37.62,67.83 v37.62,72.08
N$38  (via drill 0.35)
  Top 0.152: v133,94.83 130.62,97.2 92.38,97.2 92,96.83 91.5,96.83 91.12,97.2 85.5,97.2 81.12,92.83 69.5,92.83 69,93.33 40.38,93.33 39.75,92.7 38.75,92.7 36.75,94.7 11.5,94.7 2.75,85.95 2.75,70.95 3.75,69.95 U1.7
  Bottom 0.152: v133,94.83 134.12,93.7 134.12,89.95 133.12,88.95 133.12,87.83 J1.31
N$39  (via drill 0.35)
  Top 0.508: v161,34.83 v163.12,32.7 | v153.12,43.08 v158.38,37.83 | v151.75,45.58 148.88,48.45 v144.62,48.45 | v121,66.58 v122.12,65.45 | v106.75,68.33 96.25,78.83 v91.62,78.83 | v90.12,78.33 89.5,78.33 89.25,78.58 88.25,78.58 v84.75,82.08 | v43.62,92.7 40.5,89.58 39.5,89.58 35.5,85.58 35.5,84.45 v35.12,84.08
  Bottom 0.508: v163.12,32.7 165.75,35.33 168.88,35.33 174.62,41.08 174.62,41.33 U$2.P4 | v161,34.83 160.25,34.83 158.38,36.7 v158.38,37.83 | v153.12,43.08 153.12,44.2 v151.75,45.58 | v144.62,48.45 141.88,48.45 127.88,62.45 127.88,63.08 125.5,65.45 v122.12,65.45 | v121,66.58 121,67.2 119.88,68.33 v106.75,68.33 | v91.62,78.83 90.62,78.83 v90.12,78.33 | v84.75,82.08 84.75,82.83 85.12,83.2 85.12,83.7 76.88,91.95 73.75,91.95 73,92.7 v43.62,92.7 | v35.12,84.08 35.12,83.45 35.5,83.08 35.5,81.2 34.38,80.08 U2.14
N$40  (via drill 0.35)
  Top 0.508: v185.12,48.7 185.12,49.83 186,50.7 v186,58.83 | v183.38,66.08 183.38,68.58 v179.88,72.08 | v161,83.83 161,85.33 159.12,87.2 v146,87.2 | v131,85.58 126.62,85.58 116.88,75.83 112,75.83 v101.5,86.33 | v91.88,90.95 87,86.08 v85,86.08 | v80,91.08 50.75,91.08 48.38,88.7 46.25,88.7 46.12,88.83 39.88,88.83 v38.5,87.45 | v36.38,83.08 v38.5,85.2
  Bottom 0.508: v185.12,48.7 184.62,48.2 175.62,48.2 175,47.58 175,45.95 172.75,43.7 172.75,41.45 U$2.P3 | v186,58.83 186,61.7 183.38,64.33 v183.38,66.08 | v179.88,72.08 172.75,72.08 v161,83.83 | v146,87.2 145.25,87.95 144.75,87.95 143.62,86.83 140.88,86.83 138,83.95 133.88,83.95 132.25,85.58 v131,85.58 | v101.5,86.33 101.5,87.2 101.25,87.45 101.25,88.33 100.5,89.08 99.62,89.08 98.75,89.95 98.75,90.83 97.75,91.83 92.75,91.83 v91.88,90.95 | v80,91.08 v85,86.08 | v38.5,85.2 v38.5,87.45 | v36.38,83.08 36.38,79.45 34.38,77.45 U2.13
N$41  (via drill 0.35)
  Top 0.508: v164.5,36.83 166.38,36.83 170.62,41.08 170.62,41.33 U$2.P2 | v157.5,33.95 154.75,33.95 146.25,42.45 98.5,42.45 v97,43.95 | v87.5,74.2 87.5,75.7 v87,76.2 | v84.25,93.33 83.5,93.33 80.38,90.2 64.88,90.2 64.75,90.33 54.38,90.33 52,87.95 46.12,87.95 46,88.08 40.25,88.08 35.5,83.33 35.5,73.58 34.38,72.45 U2.11
  Bottom 0.508: v164.5,36.83 161.62,33.95 v157.5,33.95 | v97,43.95 97,52.08 97.75,52.83 97.75,53.33 97,54.08 97,57.95 90,64.95 90,72.7 89.12,73.58 88.12,73.58 v87.5,74.2 | v87,76.2 87,77.33 88.25,78.58 89.25,78.58 91,80.33 91,92.33 90,93.33 v84.25,93.33
N$42  (via drill 0.35)
  Top 0.508: v184.25,45.7 184.25,49.95 185.12,50.83 185.12,70.95 180,76.08 v180,78.33 | v133.62,95.58 v168.88,95.58 | v131.38,95.58 130.25,96.7 92.62,96.7 92.25,96.33 90.88,96.33 90.5,96.7 90,96.7 82,88.7 66.25,88.7 v64.5,86.95 | v59.62,82.08 v62,84.45
  Bottom 0.508: v184.25,45.7 185,44.95 185,41.45 U$3.P4 | v180,78.33 180,84.45 v168.88,95.58 | v133.62,95.58 133.38,95.58 133.25,95.7 131.5,95.7 v131.38,95.58 | v62,84.45 v64.5,86.95 | v59.62,82.08 58.62,81.08 53.88,81.08 52.88,80.08 U3.14
N$43  (via drill 0.35)
  Top 0.508: v183.12,46.08 183.12,49.83 184.38,51.08 184.38,59.7 184.25,59.83 184.25,70.83 v177.75,77.33 | v70.12,97.7 81.25,97.7 v82.5,96.45 | v84.62,94.33 85.38,93.58 85.38,93.08 81.75,89.45 v64.5,89.45 | v59.75,86.83 58,86.83 55.38,84.2 55.38,79.83 53,77.45 U3.13
  Bottom 0.508: v183.12,46.08 183.12,41.45 U$3.P3 | v177.75,77.33 177.75,85.58 164.75,98.58 71,98.58 v70.12,97.7 | v84.62,94.33 v82.5,96.45 | v64.5,89.45 62.38,89.45 v59.75,86.83
N$44  (via drill 0.35)
  Top 0.508: v179.38,51.7 179.38,49.33 179.12,49.08 179.12,44.33 181,42.45 181,41.45 U$3.P2 | v171.75,61.2 171.75,62.45 169.75,64.45 168.88,64.45 167.88,65.45 v167.88,75.83 | v157.88,88.45 145.38,88.45 144.88,87.95 144.75,87.95 144.38,87.58 142,87.58 139.38,90.2 139.38,90.83 137.62,92.58 v113.25,92.58 | v102.75,86.45 v108.12,86.45 | v96.25,90.95 95.62,91.58 93.75,91.58 88.38,86.2 88.25,86.2 87.25,85.2 84.25,85.2 83.75,85.7 79.12,85.7 77.25,83.83 v77.25,81.7 | v65.38,78.45 v68,81.08 | v59.88,76.08 59.88,74.7 58.62,73.45 57.75,73.45 56,71.7 53.5,71.7 52.88,72.33 U3.11
  Bottom 0.508: v179.38,51.7 179.38,52.33 171.75,59.95 v171.75,61.2 | v167.88,75.83 160.12,83.58 160.12,86.2 v157.88,88.45 | v113.25,92.58 111.5,90.83 111.5,87.33 110.62,86.45 v108.12,86.45 | v102.75,86.45 101.75,85.45 100.75,85.45 98.75,87.45 98.75,88.33 98,89.08 97.12,89.08 96.25,89.95 v96.25,90.95 | v77.25,81.7 76.62,81.08 v68,81.08 | v65.38,78.45 63.38,78.45 60.88,80.95 60.38,80.95 59.75,80.33 59.75,76.2 v59.88,76.08
N$45  (via drill 0.35)
  Top 0.508: v178.5,49.58 178.38,49.45 178.38,44.08 179,43.45 179,41.45 U$3.P1 | v172.62,52.83 171.25,52.83 169.75,54.33 166.75,54.33 164.12,56.95 161,56.95 158,53.95 v158,53.83 | v145.62,50.95 141.62,50.95 140.75,51.83 135,51.83 134.88,51.7 127.88,51.7 123.38,56.2 v123.38,56.83 | v122.12,56.83 119,56.83 v111,64.83 | v109.75,66.08 104.25,66.08 103.38,66.95 v101.5,66.95 | v99.12,67.7 97.38,67.7 v96.88,68.2 | v83.88,71.7 v85.12,72.95 | v78.25,69.2 76.5,70.95 75.5,70.95 v75,71.45 | v64.62,76.95 v67.12,76.95 | v61.88,76.95 59.62,76.95 58.75,76.08 57.88,76.08 v56.38,74.58
  Bottom 0.508: v178.5,49.58 175.88,49.58 v172.62,52.83 | v158,53.83 157.5,53.83 153,49.33 147.25,49.33 v145.62,50.95 | v122.12,56.83 v123.38,56.83 | v109.75,66.08 v111,64.83 | v101.5,66.95 100.75,67.7 v99.12,67.7 | v96.88,68.2 96.25,68.83 93.75,68.83 92,70.58 92,73.33 89.25,76.08 88.25,76.08 v85.12,72.95 | v83.88,71.7 80.75,71.7 v78.25,69.2 | v75,71.45 73.5,71.45 71.38,73.58 70.5,73.58 v67.12,76.95 | v61.88,76.95 v64.62,76.95 | v56.38,74.58 55.5,74.58 55.25,74.33 53.38,74.33 52.88,74.83 U3.12
N$46  (via drill 0.35)
  Top 0.508: v189.62,60.2 189.62,68.2 v187.5,70.33 | v130,95.83 95.88,95.83 95.62,95.58 91.12,95.58 82.75,87.2 74.62,87.2 73,85.58 73,81.95 71,79.95 U4.14
  Bottom 0.508: v189.62,60.2 195.5,54.33 195.5,48.33 195.38,48.2 195.38,41.45 U$4.P4 | v187.5,70.33 171.38,70.33 168.12,73.58 165.5,73.58 157.88,81.2 150.38,81.2 147.75,83.83 147.75,91.08 142.38,96.45 130.62,96.45 v130,95.83
N$47  (via drill 0.35)
  Top 0.508: v190.5,49.95 185.12,44.58 v180,44.58 | v175.88,44.58 174.5,43.2 154.75,43.2 153.25,44.7 150.38,44.7 149,46.08 144.62,46.08 144.5,45.95 v140.38,45.95 | v138.5,45.95 136.38,45.95 132.12,50.2 112.5,50.2 v106.25,56.45 | v101.5,56.33 101.12,56.33 97.75,59.7 v92.62,59.7 | v85.12,65.08 85.12,66.2 80.38,70.95 80.38,72.83 v80.12,73.08
  Bottom 0.508: v190.5,49.95 193.25,47.2 193.25,41.45 U$4.P3 | v175.88,44.58 v180,44.58 | v138.5,45.95 v140.38,45.95 | v106.25,56.45 102.62,56.45 102.5,56.58 101.75,56.58 v101.5,56.33 | v92.62,59.7 88,64.33 85.88,64.33 v85.12,65.08 | v80.12,73.08 77,73.08 76.5,73.58 74.62,73.58 71,77.2 U4.13
N$48  (via drill 0.35)
  Top 0.508: v191.38,47.95 191.38,48.7 197,54.33 197,61.83 v195.5,63.33 | v194.88,68.7 194.88,68.95 197.5,71.58 v197.5,86.33 | v191.25,92.58 185.12,98.7 90.88,98.7 90.75,98.83 38.12,98.83 v35.25,95.95 | v33.38,94.08 36.62,94.08 v40.25,90.45 | v49.25,81.45 52.12,81.45 52.38,81.2 53.38,81.2 v54.5,80.08
  Bottom 0.508: v191.38,47.95 191.38,41.45 U$4.P2 | v195.5,63.33 195.5,68.08 v194.88,68.7 | v191.25,92.58 v197.5,86.33 | v33.38,94.08 v35.25,95.95 | v49.25,81.45 v40.25,90.45 | v54.5,80.08 54.5,79.45 57.88,76.08 58.75,76.08 61,73.83 69.25,73.83 70.88,72.2 U4.11
N$49  (via drill 0.35)
  Top 0.508: v183.5,51.33 183.5,63.45 182.5,64.45 181.25,64.45 v178.88,66.83 | v137,78.95 137,83.33 v135.5,84.83 | v90.25,95.83 82.38,87.95 74.38,87.95 72.25,85.83 72.25,84.2 v71.88,83.83 | v69.25,76.45 v69.25,82.33
  Bottom 0.508: v183.5,51.33 183.62,51.33 189.25,45.7 189.25,41.45 U$4.P1 | v178.88,66.83 178,66.83 175.25,69.58 171.12,69.58 169.5,71.2 165.12,71.2 163.5,72.83 147,72.83 145.25,74.58 145.25,78.08 144.38,78.95 v137,78.95 | v135.5,84.83 134.38,84.83 131.75,87.45 131.75,90.83 126.88,95.7 90.38,95.7 v90.25,95.83 | v71.88,83.83 71.62,83.83 71.38,83.58 70.5,83.58 v69.25,82.33 | v69.25,76.45 70.88,74.83 U4.12
N$50  (via drill 0.35)
  Top 0.508: v195.38,37.2 199.62,41.45 U$5.P1 | v165.88,34.08 163.88,34.08 161,36.95 157.88,36.95 154.75,40.08 v153.62,40.08 | v129.12,44.83 115.75,44.83 101.38,59.2 101.38,62.45 v99,64.83 | v99,66.2 99,66.45 100,67.45 100,67.95 96.62,71.33 v91.12,71.33
  Bottom 0.508: v195.38,37.2 178.38,37.2 178,37.58 176.75,37.58 173.75,34.58 166.38,34.58 v165.88,34.08 | v153.62,40.08 152.25,40.08 148,35.83 138.12,35.83 v129.12,44.83 | v99,66.2 v99,64.83 | v91.12,71.33 91.12,72.58 88.88,74.83 U5.12
N$51  (via drill 0.35)
  Top 0.508: v193.88,47.7 195.62,47.7 200.75,42.58 200.75,42.45 201.62,41.58 U$5.P2 | v178.12,62.83 178.12,64.33 v177.5,64.95 | v92.88,72.2 88.88,72.2 U5.11
  Bottom 0.508: v193.88,47.7 188.75,52.83 188.75,53.2 187.88,54.08 187,54.08 183.25,57.83 183.25,58.58 182.5,59.33 181.62,59.33 v178.12,62.83 | v177.5,64.95 176.5,64.95 176,65.45 171.25,65.45 169.75,66.95 167.38,66.95 163,71.33 139,71.33 138.88,71.45 135.25,71.45 135.12,71.33 93.75,71.33 v92.88,72.2
N$52  (via drill 0.35)
  Top 0.508: v194.62,48.58 196.75,48.58 202.75,42.58 202.75,42.45 203.62,41.58 U$5.P3 | v179.12,64.33 179.12,64.58 v177.5,66.2
  Bottom 0.508: v194.62,48.58 194,48.58 189.5,53.08 189.5,55.08 188,56.58 187.12,56.58 183.25,60.45 183.25,61.08 182.38,61.95 181.5,61.95 v179.12,64.33 | v177.5,66.2 174.5,66.2 173.25,67.45 172.25,67.45 169.5,70.2 165.12,70.2 163.25,72.08 146.25,72.08 144.5,73.83 92.5,73.83 89.12,77.2 88.88,77.2 U5.13
N$53  (via drill 0.35)
  Top 0.508: v199.5,39.08 203.5,39.08 205.62,41.2 205.62,41.45 U$5.P4 | v175.12,37.58 175.12,34.83 v173.25,32.95 | v145.62,29.45 v158.25,29.45 | v125.38,56.2 123.62,57.95 123.62,68.2 v123.38,68.45 | v117.5,69.2 117.25,69.2 116.62,68.58 107.62,68.58 102.62,73.58 v102.62,75.7 | v91.75,79.83 91.12,79.83 v90.12,80.83
  Bottom 0.508: v199.5,39.08 198.75,38.33 190.62,38.33 190.5,38.2 186.38,38.2 186,38.58 176.12,38.58 v175.12,37.58 | v173.25,32.95 167.62,32.95 164.12,29.45 v158.25,29.45 | v145.62,29.45 144.38,30.7 134.12,30.7 125.38,39.45 v125.38,56.2 | v123.38,68.45 120.75,68.45 120,69.2 v117.5,69.2 | v102.62,75.7 99.38,78.95 92.62,78.95 v91.75,79.83 | v90.12,80.83 89.75,80.83 88.88,79.95 U5.14
N$54  (via drill 0.35)
  Top 0.152: R24.2 63.75,84.58 62.75,84.58 62.25,85.08 58.5,85.08 58.38,84.95 U4.1 58.25,84.83 57.25,83.83 57.25,80.45 53.25,76.45 52.38,76.45 50.5,78.33 48.25,78.33 47.88,77.95 47.88,77.45 48.25,77.08 48.5,77.08 50.12,75.45 v50.12,73.2 | v53.75,60.2 53.75,60.58 v54.88,61.7
  Bottom 0.152: JP8.1 57.62,36.2 53.88,39.95 53.88,46.45 52.88,47.45 52.5,47.45 51.88,48.08 51.88,59.2 52.88,60.2 v53.75,60.2 | v54.88,61.7 54.88,62.83 50.12,67.58 v50.12,73.2
N$55  (via drill 0.35)
  Top 0.152: v29.62,28.45 33.5,24.57 33.5,20.82 SW7.1 | v23.25,39.83 19.38,43.7 19.38,55.33 22.5,58.45 U7.2
  Bottom 0.152: v29.62,28.45 29.62,33.45 v23.25,39.83
N$56  (via drill 0.35)
  Top 0.152: SW8.4 46.38,12.7 48.75,12.7 SW8.5 48.88,12.7 51.25,12.7 SW8.6 51.38,12.7 52.38,13.7 52.38,26.7 59.25,33.58 60.5,33.58 v61.38,32.7 | v185.38,80.58 186.38,79.58 R16.2 | v183.38,82.58 164.62,82.58 159.38,87.83 145.75,87.83 v145,87.08 | v136.12,82.45 136.12,77.7 133.38,74.95 v133.38,52.58 | v128.5,38.33 128.5,36.2 v123.75,31.45
  Bottom 0.152: v183.38,82.58 v185.38,80.58 | v145,87.08 144.62,87.08 143.88,86.33 141.12,86.33 137.25,82.45 v136.12,82.45 | v133.38,52.58 133.38,50.33 128.5,45.45 v128.5,38.33 | v123.75,31.45 123.75,30.95 123.88,30.82 123.88,30.32 122.12,28.57 96.12,28.57 95.25,29.45 89.5,29.45 87.25,31.7 67.38,31.7 66.38,32.7 v61.38,32.7
N$57  (via drill 0.35)
  Top 0.152: v38.88,27.7 38.88,52.33 40.12,53.58 U8.4
  Bottom 0.152: v38.88,27.7 46.25,20.32 SW8.3
N$58  (via drill 0.35)
  Top 0.152: v46.5,17.95 48.75,20.2 SW8.2 | v24.25,37.95 24.25,39.08 v33.88,48.7
  Bottom 0.152: v46.5,17.95 33.12,17.95 31.88,19.2 30.62,19.2 29.5,20.32 29.5,25.95 23.5,31.95 23.5,37.2 v24.25,37.95 | v33.88,48.7 33.88,51.08 35.25,52.45 36,52.45 39.62,56.08 40.12,56.08 U8.3
N$59  (via drill 0.35)
  Top 0.152: v38.25,33.33 38.25,40.7 38.5,40.95 38.5,41.83 37.62,42.7 37.62,51.2 37.75,51.33 37.75,60.45 v37.62,60.58
  Bottom 0.152: v38.25,33.33 51.25,20.32 SW8.1 | v37.62,60.58 38.25,60.58 40.12,58.7 U8.2
N$60  (via drill 0.35)
  Top 0.152: SW9.4 64.25,13.32 66.62,13.32 SW9.5 66.75,13.32 69.12,13.32 SW9.6 69.25,13.2 69.75,12.7 70.75,12.7 74.38,16.32 87.5,16.32 90.25,19.07 109.75,19.07 125.25,34.58 125.25,36.2 122.75,38.7 v122.75,39.2 | v198.5,86.2 198.5,84.45 203.12,79.83 203.12,79.58 R18.2 | v172.88,93.2 139.62,93.2 v138.88,92.45 | v135,85.7 125.88,76.58 v125.38,76.58 | v126,75.45 126,75.2 117.88,67.08 117.75,67.08 117.38,66.7 117.38,62.45 122.75,57.08 v122.75,51.83
  Bottom 0.152: v198.5,86.2 191.5,93.2 v172.88,93.2 | v138.88,92.45 136.75,90.33 136.75,87.45 v135,85.7 | v125.38,76.58 125.38,76.08 v126,75.45 | v122.75,39.2 v122.75,51.83
N$61  (via drill 0.35)
  Top 0.152: v64.88,28.2 64.25,27.57 64.25,20.95 SW9.3 | v64.88,33.33 v64.88,30.2 | v62.62,48.2 62.62,48.7 58.38,52.95 58.38,53.58 U9.4
  Bottom 0.152: v64.88,30.2 v64.88,28.2 | v64.88,33.33 62.62,35.58 v62.62,48.2
N$62  (via drill 0.35)
  Top 0.152: v64.25,43.33 69.88,37.7 69.88,28.07 66.75,24.95 66.75,20.95 SW9.2 | v64.25,46.83 64.25,49.95 61.12,53.08 v61.12,54.2
  Bottom 0.152: v64.25,46.83 v64.25,43.33 | v61.12,54.2 60.25,54.2 58.38,56.08 U9.3
N$63  (via drill 0.35)
  Top 0.152: v64.62,54.2 64.62,52.08 65.25,51.45 65.25,44.95 70.62,39.58 70.62,27.82 69.25,26.45 69.25,20.95 SW9.1 | v60.75,52.08 60.75,52.45 59.38,53.83 59.38,57.58 58.38,58.58 U9.2
  Bottom 0.152: v64.62,54.2 62.88,54.2 v60.75,52.08
N$64  (via drill 0.35)
  Top 0.152: SW10.4 81.62,13.57 84,13.57 SW10.5 84.12,13.57 86.5,13.57 SW10.6 | v209.62,46.08 214,50.45 214,60.33 217.62,63.95 218,63.95 220.62,66.58 220.62,78.95 R20.2 | v148.25,4.08 142.75,4.08 v132.5,14.32
  Bottom 0.152: v209.62,46.08 209.62,39.95 207.75,38.08 207.75,24.07 199.38,15.7 199.38,7.45 197.38,5.45 187.62,5.45 186.25,4.08 v148.25,4.08 | v132.5,14.32 126.12,14.32 118.5,21.95 103.12,21.95 95.25,14.07 87.12,14.07 86.62,13.57 SW10.6
N$65  (via drill 0.35)
  Top 0.152: v71.62,30.57 71.62,41.33 69,43.95 v69,50.2 | v74.62,52.2 75.75,53.33 U10.4
  Bottom 0.152: v71.62,30.57 81,21.2 81.5,21.2 SW10.3 | v69,50.2 69,51.58 69.62,52.2 v74.62,52.2
N$66  (via drill 0.35)
  Top 0.152: v83.88,33.08 87.12,29.82 87.12,27.95 86.5,27.32 86.38,27.32 84.12,25.07 84.12,21.2 SW10.2 | v68.25,50.95 v68.25,42.83
  Bottom 0.152: v83.88,33.08 78,33.08 v68.25,42.83 | v68.25,50.95 68.25,54.95 70.5,57.2 74.5,57.2 75.75,55.95 U10.3
N$67  (via drill 0.35)
  Top 0.152: v73.25,30.57 73.25,36.33 72.62,36.95 72.62,55.33 75.75,58.45 U10.2
  Bottom 0.152: v73.25,30.57 73.25,29.45 76.88,25.82 81.38,25.82 86,21.2 86.5,21.2 SW10.1
N$68  (via drill 0.35)
  Top 0.152: SW6.6 14.88,13.57 12.5,13.57 SW6.5 12.38,13.57 9.88,13.57 SW6.4 | v151.25,86.08 151.25,80.33 150.12,79.2 R12.2
  Bottom 0.152: v151.25,86.08 151.25,88.33 141.5,98.08 71.38,98.08 69.88,96.58 12.5,96.58 1.12,85.2 1.12,22.2 9.75,13.57 SW6.4
N$69
  Bottom 0.152: U6.4 1.5,51.2 1.5,34.08 9.75,25.82 9.75,21.2 SW6.3
N$70  (via drill 0.35)
  Top 0.152: v2.12,50.95 2.12,54.45 3.75,56.08 U6.3
  Bottom 0.152: v2.12,50.95 2.12,33.95 12.38,23.7 12.38,21.2 SW6.2
N$71
  Bottom 0.152: SW6.1 14.88,21.2 14.88,21.7 2.5,34.08 2.5,48.58 3.88,49.95 4.25,49.95 4.88,50.58 4.88,57.58 3.88,58.58 U6.2
N$72  (via drill 0.35)
  Top 0.152: v130.12,82.83 128.12,82.83 127.62,83.33 126.38,83.33 112.5,69.45 v107.88,69.45 | v101,65.95 v103.25,65.95 | v98.5,63.45 89.5,63.45 v87,60.95 | v78.38,56.95 75.88,54.45 74.38,54.45 73,53.08 73,37.08 73.88,36.2 v73.88,25.82 | v73.88,21.7 73.5,21.7 66.62,14.82 62.25,14.82 58.38,10.95 46,10.95 43.25,13.7 43.25,14.45 43,14.7 36,14.7 v35,13.7
  Bottom 0.152: v130.12,82.83 129.88,83.08 129.88,86.7 130.5,87.33 130.5,87.7 J1.29 | v107.88,69.45 106.75,69.45 v103.25,65.95 | v98.5,63.45 v101,65.95 | v87,60.95 87,60.58 83.38,56.95 v78.38,56.95 | v73.88,21.7 v73.88,25.82 | v35,13.7 31.25,17.45 24.75,17.45 13.12,29.07 13.12,31.57 5.25,39.45 5.25,58.7 3.88,60.08 3.12,60.08 2.88,60.33 2.88,66.33 3.75,67.2 U1.8
N$73  (via drill 0.35)
  Top 0.508: v161.62,16.82 161.62,16.2 159.38,13.95 v138.38,13.95 | v23.62,46.58 23,47.2 22,47.2 20.38,48.83 v20.38,54.2
  Bottom 0.508: v161.62,16.82 165,20.2 165,24.95 U$6.P4 | v138.38,13.95 136.5,13.95 126.88,4.33 101.12,4.33 98.38,1.57 84.75,1.57 71,15.32 67.5,15.32 66.75,16.07 63.75,16.07 61.88,17.95 59.25,17.95 49.62,27.57 49.62,30.32 48.38,31.57 41.25,31.57 29.5,43.33 29.5,45.83 28.75,46.58 v23.62,46.58 | v20.38,54.2 18.62,54.2 16.62,56.2 U6.14
N$74  (via drill 0.35)
  Top 0.508: v153.62,27.45 160.75,27.45 162.12,26.07 162.12,25.95 163,25.07 U$6.P3 | v148.88,27.45 144.38,22.95 135.5,22.95 133,20.45 116.5,20.45 v116.38,20.57 | v23.12,52.2 v27.25,48.08
  Bottom 0.508: v148.88,27.45 v153.62,27.45 | v116.38,20.57 98.12,2.33 85,2.33 71.25,16.07 67.75,16.07 67,16.82 64,16.82 62.12,18.7 59.5,18.7 52.12,26.07 52.12,30.32 50.12,32.33 41.5,32.33 30.25,43.58 30.25,46.08 28.25,48.08 v27.25,48.08 | v23.12,52.2 17.88,52.2 16.62,53.45 U6.13
N$75  (via drill 0.35)
  Top 0.508: v153.88,25.82 154.75,26.7 159.5,26.7 160.12,26.07 160.12,25.95 161,25.07 U$6.P2 | v142.12,20.45 134,20.45 133.25,19.7 114.62,19.7 v114.5,19.82
  Bottom 0.508: v153.88,25.82 148.5,20.45 v142.12,20.45 | v114.5,19.82 97.75,3.08 85.25,3.08 71.5,16.82 68,16.82 67.25,17.57 64.25,17.57 62.38,19.45 59.75,19.45 53.88,25.32 53.88,30.57 51.38,33.08 41.75,33.08 33,41.83 33,44.33 28.38,48.95 24.75,48.95 23,47.2 17.88,47.2 16.62,48.45 U6.11
N$76  (via drill 0.35)
  Top 0.508: v151.12,24.95 159,24.95 U$6.P1 | v148.88,24.95 142.88,18.95 112.75,18.95 v112.62,19.07
  Bottom 0.508: v148.88,24.95 v151.12,24.95 | v112.62,19.07 97.38,3.83 85.5,3.83 71.75,17.57 68.25,17.57 67.5,18.32 66,18.32 65.25,19.07 63.75,19.07 59.75,23.07 59.75,27.32 53.25,33.83 42,33.83 33.75,42.08 33.75,44.58 28.62,49.7 17.88,49.7 16.62,50.95 U6.12
N$77  (via drill 0.35)
  Top 0.508: v169.25,28.32 168.88,28.7 168.88,28.82 164.38,33.33 163.62,33.33 160.88,36.08 v160.75,36.08 | v159,39.58 v160.75,37.83 | v150.25,45.95 149.25,46.95 v145.5,46.95 | v114.5,54.45 v122.12,54.45 | v102.75,50.95 100.25,48.45 93.75,48.45 v91,51.2 | v68.75,68.45 68.25,68.45 62.5,62.7 52.62,62.7 v51.38,61.45 | v46.38,58.2 46.38,56.58 v46.25,56.45
  Bottom 0.508: v169.25,28.32 169.25,25.07 U$7.P1 | v160.75,37.83 v160.75,36.08 | v159,39.58 158.25,39.58 156.62,41.2 156.62,46.7 156,47.33 154.5,47.33 153.62,46.45 150.75,46.45 v150.25,45.95 | v145.5,46.95 144.5,45.95 142,45.95 135.5,52.45 135.5,52.83 129.75,58.58 126.12,58.58 124.25,56.7 124.25,56.58 v122.12,54.45 | v114.5,54.45 111,50.95 v102.75,50.95 | v91,51.2 91,60.33 87.75,63.58 81.12,63.58 79.5,65.2 74.62,65.2 71.38,68.45 v68.75,68.45 | v51.38,61.45 51.38,61.2 48.25,58.08 46.5,58.08 v46.38,58.2 | v46.25,56.45 42.25,56.45 40.62,54.83 39.12,54.83 35.25,50.95 U7.12
N$78  (via drill 0.35)
  Top 0.508: v171,19.45 175.25,23.7 175.25,24.95 U$7.P4 | v163.75,27.7 160.25,31.2 160.25,31.32 158.5,33.08 149.62,33.08 144.38,38.33 137.88,38.33 136.38,39.83 135.88,39.83 131.75,35.7 131.75,30.32 131.12,29.7 v122,29.7 | v97.25,36.45 v115.25,36.45 | v87.88,37.45 87.88,27.95 v86.25,26.32 | v76,27.57 76,25.45 67.75,17.2 61.75,17.2 v61.62,17.07 | v47,27.32 44.88,27.32 39.5,32.7 v39.5,38.83 | v36.5,45.45 36.5,48.83 35.62,49.7 v33.25,49.7
  Bottom 0.508: v171,19.45 171,20.07 166.12,24.95 166.12,26.07 164.5,27.7 v163.75,27.7 | v115.25,36.45 v122,29.7 | v97.25,36.45 95.38,38.33 89.25,38.33 88,39.58 87.5,39.58 86.88,38.95 86.88,38.45 v87.88,37.45 | v86.25,26.32 77.25,26.32 v76,27.57 | v61.62,17.07 57.25,17.07 v47,27.32 | v39.5,38.83 36.75,41.58 36.75,45.2 v36.5,45.45 | v33.25,49.7 33.25,54.08 35.12,55.95 U7.14
N$79  (via drill 0.35)
  Top 0.508: v166.38,15.95 173.25,22.82 173.25,24.95 U$7.P3 | v160.25,15.95 159.12,14.82 v140,14.82 | v137.5,17.32 136.75,17.32 136.62,17.45 109,17.45 v108.88,17.57 | v52.25,38.95 v52.25,36.7 | v37.12,51.58 35.25,53.45 U7.13
  Bottom 0.508: v160.25,15.95 v166.38,15.95 | v137.5,17.32 v140,14.82 | v108.88,17.57 96.62,5.33 86,5.33 72.25,19.07 68.75,19.07 67.75,20.07 67.75,22.07 63.5,26.32 62.75,26.32 52.38,36.7 v52.25,36.7 | v52.25,38.95 41.38,49.83 38.88,49.83 v37.12,51.58
N$80  (via drill 0.35)
  Top 0.152: v150.62,82.08 150.12,81.58 150.12,80.83 R12.1 | v158.38,82.08 166.12,82.08 166.88,81.33 | 166.88,81.33 167,81.2 R14.1 166.88,81.33 | 186,81.2 181.38,81.2 181.25,81.33 166.88,81.33 | 186,81.2 R16.1 186.38,81.2 | 186,81.2 186,85.7 187.25,86.95 198.62,86.95 203.12,82.45 203.12,81.33 R18.1 203.25,81.33 203.88,81.33 204.12,81.58 219.88,81.58 220.62,80.83 R20.1 220.75,80.7 220.75,80.33 221.5,79.58 v221.5,60.58 | U13.10 200.25,52.7 200.25,52.2 208.75,43.7 209.25,43.7 215.62,50.08 215.62,54.33 217.62,56.33 218.5,56.33 219.12,55.7 219.12,53.83 218.12,52.83 U14.10 | 181,49.95 181,47.33 183.25,45.08 184.75,45.08 v196.12,56.45 | 181,49.95 181,50.83 182,51.83 182,52.95 U12.10 | v173.62,52.95 172.62,51.95 168.88,51.95 167.75,53.08 163.75,53.08 U11.10 | 181,49.95 v180.25,49.95 | v51.75,15.57 42.5,15.57 R36.1 | 59.12,15.57 59.38,15.57 60.5,16.7 R38.1 | 59.12,15.57 v55,15.57 | 59.12,15.57 59.12,31.7 59.88,32.45 59.88,32.7 R8.1 | 42.5,34.83 42.5,34.95 45,37.45 45,38.2 52.75,45.95 U8.10 | 42.5,34.83 42.5,33.2 R6.1 | 24.88,18.82 24.88,19.07 23.5,20.45 23.5,32.45 24.38,33.33 R4.1 24.5,33.45 25.5,34.45 25.5,35.45 | 24.88,18.82 24.88,16.07 R29.1 | 25.5,35.45 25.5,36.2 35.12,45.83 U7.10 | v42.12,34.83 42.5,34.83 | 24.88,18.82 v28,18.82 | R27.1 5.62,16.82 5.62,19.82 5,20.45 5,32.58 5.75,33.33 R2.1 5.75,35.2 16.5,45.95 U6.10 16.62,45.95 | 16.62,45.95 17.62,46.95 17.62,67.58 16.5,68.7 U1.10 | v50.75,67.83 47.62,67.83 45.75,65.95 39.75,65.95 35.88,69.83 34.38,69.83 U2.10 | 25.5,35.45 24,35.45 18.88,40.58 18.88,43.7 16.62,45.95 | v73.62,70.33 73,69.7 U4.10 69.12,69.7 68.62,70.2 67.62,70.2 66.25,68.83 v65.12,68.83
  Top 0.152: v76.75,44.2 81.75,44.2 83.25,45.7 88.5,45.7 U10.10 | 77.62,19.45 77.62,19.57 76.62,20.57 76.62,32.2 77.25,32.83 R10.1 77.38,32.95 78.12,33.7 v80.25,33.7 | 77.62,19.45 77.62,17.32 R40.1 | v119.88,21.45 133.25,21.45 133.62,21.82 133.62,21.95 143.25,31.57 143.25,31.82 JP2.5 | v89.12,21.7 86.88,19.45 77.62,19.45 | v60.38,70.58 60.25,70.7 55.62,70.7 54.88,69.95 52.88,69.95 U3.10 | v159.38,31.07 159.38,30.57 164,25.95 164,23.95 163.38,23.32 v150.25,23.32